# Altium project PCB_Project.PrjPcb
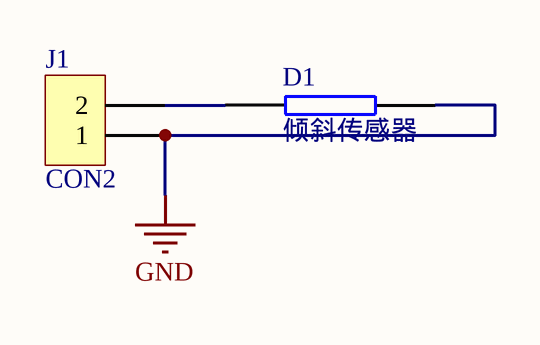
[diagram p0: qinxie.SchDoc]
1 sheet, 2 parts. Net scope: global (net labels, ports and power ports of the same name join across sheets).
Board file: qinxie.PcbDoc

## Sheet qinxie.SchDoc
size A4

### Parts
D1  倾斜传感器  [倾斜传感器]
J1  CON2  [J-SH1.0-T-1-LT-2A]

### Nets
GND: D1.2 J1.1
NetD1_1: D1.1 J1.2

### Library data of the parts
D1 = R
J1 = CON2: Connector